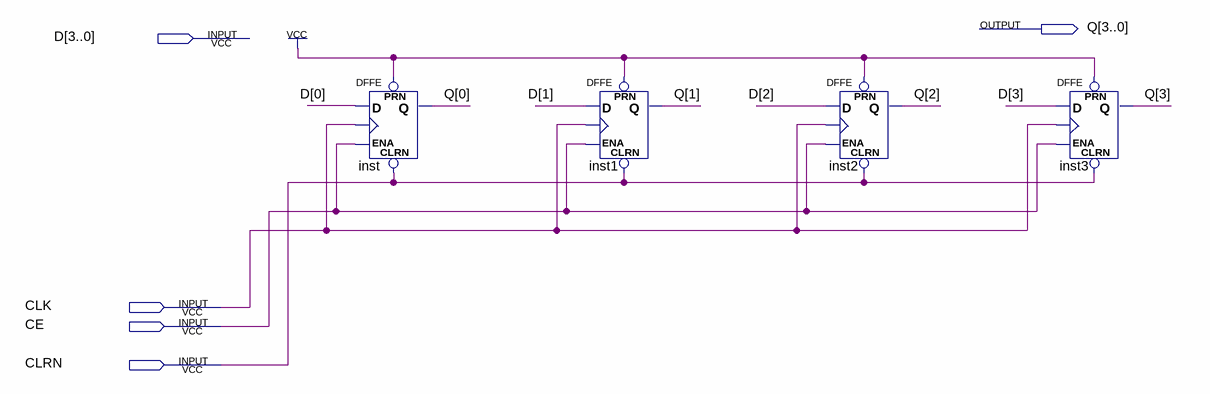
[diagram p0: schematic sheet]
// Quartus schematic dffe4bit.bdf as structural Verilog: 4 symbols, 5 pins
module dffe4bit (
  input  [3:0] D,
  input  CLK,
  input  CE,
  input  CLRN,
  output [3:0] Q
);

  DFFE inst (.PRN(1'b1), .CLRN(CLRN), .D(D[0]), .CLK(CLK), .ENA(CE), .Q(Q[0]));
  DFFE inst1 (.PRN(1'b1), .CLRN(CLRN), .D(D[1]), .CLK(CLK), .ENA(CE), .Q(Q[1]));
  DFFE inst2 (.PRN(1'b1), .CLRN(CLRN), .D(D[2]), .CLK(CLK), .ENA(CE), .Q(Q[2]));
  DFFE inst3 (.PRN(1'b1), .CLRN(CLRN), .D(D[3]), .CLK(CLK), .ENA(CE), .Q(Q[3]));
endmodule
